# Altium schematic sheet io_a.SchDoc: I/O bank A
size A4; SheetNumber: 9; SheetTotal: 11
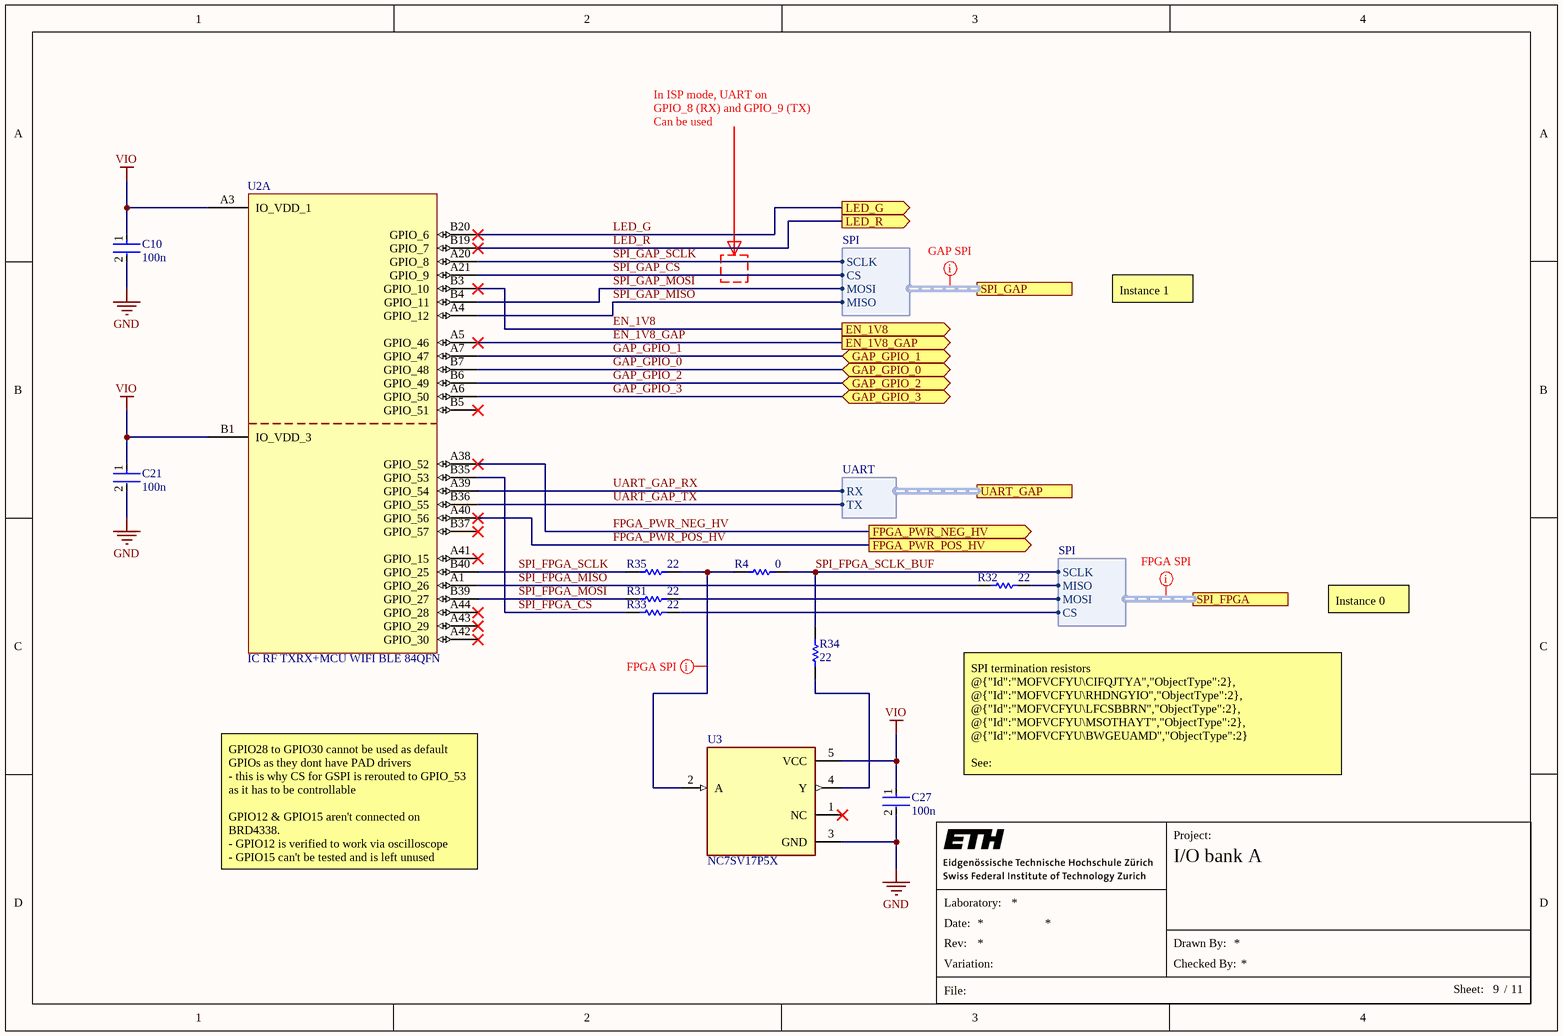
[diagram p0: io_a.SchDoc]

## Parts
C10  100n  [FP-GRT155-0_05-MFG]
C21  100n  [FP-GRT155-0_05-MFG]
C27  100n  [FP-GRT155-0_05-MFG]
R4  value 0  [RESC1005X40X25ML05T10]  (hidden comment: Resistor 0R 0402 63 mW)
R31  22  [RESC1005X40X25LL05T10]
R32  22  [RESC1005X40X25LL05T10]
R33  22  [RESC1005X40X25LL05T10]
R34  22  [RESC1005X40X25LL05T10]
R35  22  [RESC1005X40X25LL05T10]
U2  IC RF TXRX+MCU WIFI BLE 84QFN  [SIWG917M110LGTBA]  (part A of 4)
U3  NC7SV17P5X  [SOT65P210X110-5N]

## Ports
EN_1V8 (out, see power_io[6B], power_conversion[2D], power_io[6B]), EN_1V8_GAP (out, see power_io[6B], power_conversion[1B], power_io[6B]), FPGA_PWR_NEG_HV (out, see power_io[6B]), FPGA_PWR_POS_HV (out, see power_io[6B]), GAP_GPIO_0 (bidir, see power_io[6B], gap[3C], power_io[6B]), GAP_GPIO_1 (bidir, see power_io[6B], gap[3C], power_io[6B]), GAP_GPIO_2 (bidir, see power_io[6B], gap[3C], power_io[6B]), GAP_GPIO_3 (bidir, see power_io[6B], gap[3C], power_io[6B]), LED_G (out, see power_io[6B], debug_interface[1D], power_io[6B]), LED_R (out, see power_io[6B], debug_interface[1D], power_io[6B]), SPI_FPGA (harness SPI, see power_io[6B], connectors[4B], power_io[6B]), SPI_GAP (harness SPI, see power_io[6B], gap[3C], power_io[6B]), UART_GAP (harness UART, see power_io[6B], gap[1C], power_io[6B])

## Harnesses
SPI: SCLK, MISO, MOSI, CS
UART: TX, RX

## Nets
GND: C10.2 C21.2 C27.2 U3.3(GND)
VIO: C10.1 C21.1 C27.1 U2.A3(IO_VDD_1) U2.B1(IO_VDD_3) U3.5(VCC)
EN_1V8: U2.B3(GPIO_10) ; port EN_1V8
EN_1V8_GAP: U2.A5(GPIO_46) ; port EN_1V8_GAP
FPGA_PWR_NEG_HV: U2.A38(GPIO_52) ; port FPGA_PWR_NEG_HV
FPGA_PWR_POS_HV: U2.A40(GPIO_56) ; port FPGA_PWR_POS_HV
GAP_GPIO_0: U2.B7(GPIO_48) ; port GAP_GPIO_0
GAP_GPIO_1: U2.A7(GPIO_47) ; port GAP_GPIO_1
GAP_GPIO_2: U2.B6(GPIO_49) ; port GAP_GPIO_2
GAP_GPIO_3: U2.A6(GPIO_50) ; port GAP_GPIO_3
LED_G: U2.B20(GPIO_6) ; port LED_G
LED_R: U2.B19(GPIO_7) ; port LED_R
SPI_FPGA_CS: R33.1 U2.B35(GPIO_53)
SPI_FPGA_MISO: R32.1 U2.A1(GPIO_26)
SPI_FPGA_MOSI: R31.1 U2.B39(GPIO_27)
SPI_FPGA_SCLK: R35.1 U2.B40(GPIO_25)
SPI_FPGA_SCLK_BUF: R4.2 R34.2 ; port SPI_FPGA.SCLK
SPI_GAP_CS: U2.A21(GPIO_9) ; port SPI_GAP.CS
SPI_GAP_MISO: U2.A4(GPIO_12) ; port SPI_GAP.MISO
SPI_GAP_MOSI: U2.B4(GPIO_11) ; port SPI_GAP.MOSI
SPI_GAP_SCLK: U2.A20(GPIO_8) ; port SPI_GAP.SCLK
UART_GAP_RX: U2.A39(GPIO_54) ; port UART_GAP.RX
UART_GAP_TX: U2.B36(GPIO_55) ; port UART_GAP.TX
NetR4_1: R4.1 R35.2 U3.2(A)
NetR31_2: R31.2 ; port SPI_FPGA.MOSI
NetR32_2: R32.2 ; port SPI_FPGA.MISO
NetR33_2: R33.2 ; port SPI_FPGA.CS
NetR34_1: R34.1 U3.4(Y)

Not connected (* = marked no-connect by the designer): U2 A41(GPIO_15)* A42(GPIO_30)* A43(GPIO_29)* A44(GPIO_28)* B5(GPIO_51)* B37(GPIO_57)*; U3 1(NC)*

## Layout directives
net class SPI_GAP: (no net found under the mark)
net class SPI_FPGA: (no net found under the mark), NetR4_1

## Notes on the sheet
- In ISP mode, UART on
  GPIO_8 (RX) and GPIO_9 (TX)
  Can be used
- Instance 1
- Instance 0
- SPI termination resistors @{"Id":"MOFVCFYU\CIFQJTYA","ObjectType":2}, @{"Id":"MOFVCFYU\RHDNGYIO","ObjectType":2}, @{"Id":"MOFVCFYU\LFCSBBRN","ObjectType":2}, @{"Id":"MOFVCFYU\MSOTHAYT","ObjectType":2}, @{"Id":"MOFVCFYU\BWGEUAMD","ObjectType":2}
  See: https://resources.altium.com/de/p/there-spi-trace-impedance-requirement
  Place master resistors @{"Id":"MOFVCFYU\CIFQJTYA","ObjectType":2}, @{"Id":"MOFVCFYU\LFCSBBRN","ObjectType":2}, @{"Id":"MOFVCFYU\BWGEUAMD","ObjectType":2} close to the SOC
  Place slave resistor @{"Id":"MOFVCFYU\RHDNGYIO","ObjectType":2} close to the connector
  Place clock buffer resistor @{"Id":"MOFVCFYU\MSOTHAYT","ObjectType":2} close to the buffer
- GPIO28 to GPIO30 cannot be used as default GPIOs as they dont have PAD drivers
  - this is why CS for GSPI is rerouted to GPIO_53 as it has to be controllable
  GPIO12 & GPIO15 aren't connected on BRD4338.
  - GPIO12 is verified to work via oscilloscope
  - GPIO15 can't be tested and is left unused
- Project:
- Laboratory:
- Date:
- File:
- Rev:
- Variation:
- Drawn By:
- Checked By:
- Sheet:
- /

## Library data of the parts
C10 C21 C27 = CMP-06035-014200-1: Multi-Layer Ceramic Capacitor 100nF 50V X7R ±10% 0402 Paper T/R
R4 = CMP-009-00004-5: Chip Resistor, 0 Ohm, 0.063 W, -55 to 155 degC, 0402 (1005 Metric); Power: 63mW; Voltage Rating: 50V; Max Operating Temperature: 155°C; Pins: 2; RoHS Compliant: True; Min Operating Temperature: -55°C; Mounting Technology: SM; Case/Package: 0402
R31-R35 = CMP-2002-07520-1: Manufacturer: Yageo / Phycomp; Part Number: RC0402FR-0722RL
U2 = SIWG917
U3 = NC7SV17P5X: Buffer, Non-Inverting 1 Element 1 Bit per Element Push-Pull Output SC-70-5; MF: {'manufacturer': u'ON Semiconductor'}; Package: None; Price: None; Value: *; MP: NC7SV17P5X; Availability: Unavailable